# Altium schematic sheet Audio_Det.SchDoc: Mynd-Audio-Detect
size A3; PageSetup: Record=PageOptions|CenterHorizontal=True|CenterVertical=True|PrintScale=0.71|XCorrection=1.00|YCorrection=1.00|PrintKind=0|BorderSize=5000000|LeftOffset=0|BottomOffset=0|Orientation=2|PaperLength=1000|PaperWidth=1000|Scale=100|PaperSource=7|PrintQuality=-3|MediaType=1|DitherType=10|PrintScaleMode=1|PaperKind=A4|PaperIndex=9; SheetNumber: 5; SheetTotal: 6
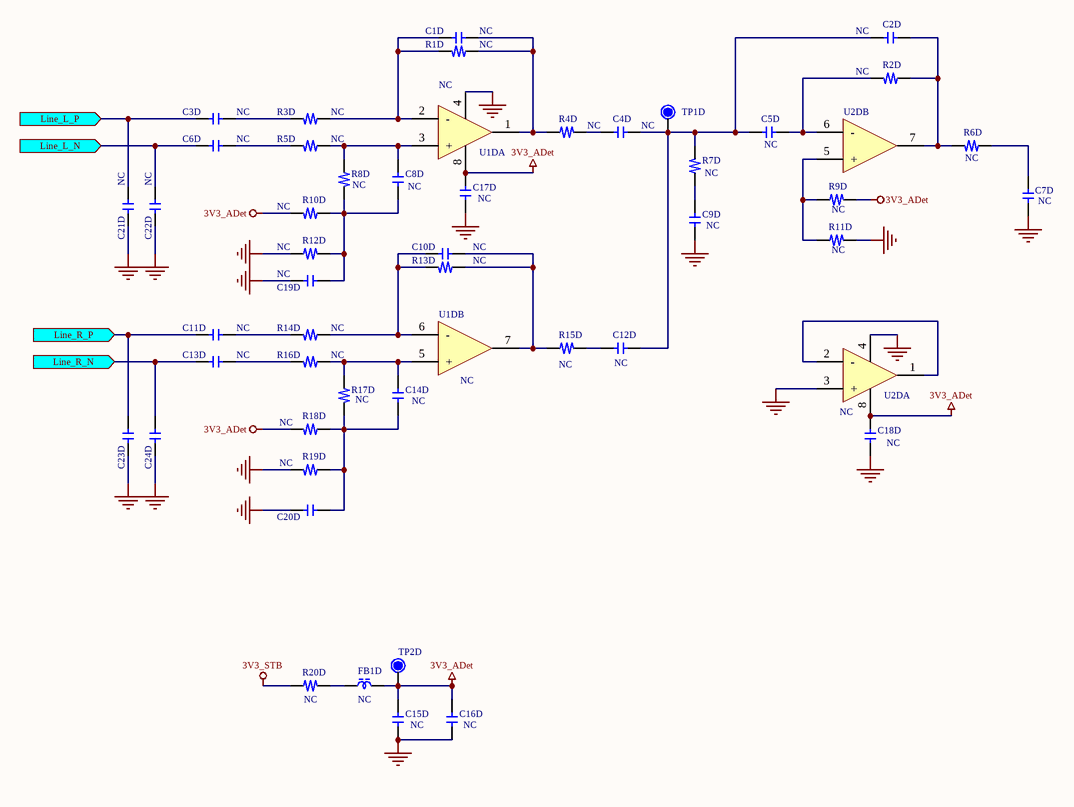
[diagram p0: Audio_Det.SchDoc]

## Parts
C1D  47pF  [C0603X80]  (value not drawn)
C2D  4.7uF  [C0603X100]  (value not drawn)
C3D  100nF  [C0603X100]  (value not drawn)
C4D  470nF  [C0603X100]  (value not drawn)
C5D  150nF  [C0603X100]  (value not drawn)
C6D  100nF  [C0603X100]  (value not drawn)
C7D  10nF  [C0603X100]  (value not drawn)
C8D  47pF  [C0603X80]  (value not drawn)
C9D  10uF  [C0805_145]  (value not drawn)
C10D  47pF  [C0603X80]  (value not drawn)
C11D  100nF  [C0603X100]  (value not drawn)
C12D  470nF  [C0603X100]  (value not drawn)
C13D  100nF  [C0603X100]  (value not drawn)
C14D  47pF  [C0603X80]  (value not drawn)
C15D  10uF  [C0805_145]  (value not drawn)
C16D  100nF  [C0603X100]  (value not drawn)
C17D  100nF  [C0603X100]  (value not drawn)
C18D  100nF  [C0603X100]  (value not drawn)
C19D  4.7uF  [C0603X105]  (value not drawn)
C20D  4.7uF  [C0603X105]  (value not drawn)
C21D  470pF  [C0603X80]  (value not drawn)
C22D  470pF  [C0603X80]  (value not drawn)
C23D  470pF  [C0603X80]  (value not drawn)
C24D  470pF  [C0603X80]  (value not drawn)
FB1D  600R  [L0603]  (value not drawn)
R1D  10k  [R0603]  (value not drawn)
R2D  680k  [R0603]  (value not drawn)
R3D  10k  [R0603]  (value not drawn)
R4D  15R  [R0603]  (value not drawn)
R5D  10k  [R0603]  (value not drawn)
R6D  560R  [R0603]  (value not drawn)
R7D  1.5k  [R0603]  (value not drawn)
R8D  10k  [R0603]  (value not drawn)
R9D  100k  [R0603]  (value not drawn)
R10D  33k  [R0603]  (value not drawn)
R11D  100k  [R0603]  (value not drawn)
R12D  33k  [R0603]  (value not drawn)
R13D  10k  [R0603]  (value not drawn)
R14D  10k  [R0603]  (value not drawn)
R15D  15R  [R0603]  (value not drawn)
R16D  10k  [R0603]  (value not drawn)
R17D  10k  [R0603]  (value not drawn)
R18D  33k  [R0603]  (value not drawn)
R19D  33k  [R0603]  (value not drawn)
R20D  2.2R  [R0805]  (value not drawn)
TP1D  TP  [TP060]  (value not drawn)  (no BOM)
TP2D  TP  [TP060]  (value not drawn)  (no BOM)
U1D  (no value)  [VSSOP8]  (parts A,B of 2)
U2D  (no value)  [VSSOP8]  (parts A,B of 2)

## Ports
Line_L_N (in), Line_L_P (in), Line_R_N (in), Line_R_P (in)

## Nets
3V3_ADet: C15D.2 C16D.1 C17D.1 C18D.1 FB1D.2 R9D.1 R10D.1 R18D.1 TP2D.1 U1D.8(+V) U2D.8(+V)
3V3_STB: R20D.2
GND: C7D.2 C9D.2 C15D.1 C16D.2 C17D.2 C18D.2 C19D.2 C20D.2 C21D.2 C22D.2 C23D.2 C24D.2 R11D.1 R12D.2 R19D.1 U1D.4(-V) U2D.3(+) U2D.4(-V)
Line_L_N: C6D.2 C22D.1 ; port Line_L_N
Line_L_P: C3D.2 C21D.1 ; port Line_L_P
Line_R_N: C13D.2 C24D.1 ; port Line_R_N
Line_R_P: C11D.2 C23D.1 ; port Line_R_P
NetC1D_1: C1D.1 R1D.2 R4D.2 U1D.1(OUT)
NetC1D_2: C1D.2 R1D.1 R3D.2 U1D.2(-)
NetC2D_1: C2D.1 R2D.2 R6D.1 U2D.7(OUT)
NetC2D_2: C2D.2 C4D.1 C5D.2 C12D.1 R7D.1 TP1D.1
NetC3D_1: C3D.1 R3D.1
NetC4D_2: C4D.2 R4D.1
NetC5D_1: C5D.1 R2D.1 U2D.6(-)
NetC6D_1: C6D.1 R5D.1
NetC7D_1: C7D.1 R6D.2
NetC8D_1: C8D.1 C19D.1 R8D.1 R10D.2 R12D.1
NetC8D_2: C8D.2 R5D.2 R8D.2 U1D.3(+)
NetC9D_1: C9D.1 R7D.2
NetC10D_1: C10D.1 R13D.2 R15D.2 U1D.7(OUT)
NetC10D_2: C10D.2 R13D.1 R14D.2 U1D.6(-)
NetC11D_1: C11D.1 R14D.1
NetC12D_2: C12D.2 R15D.1
NetC13D_1: C13D.1 R16D.1
NetC14D_1: C14D.1 C20D.1 R17D.1 R18D.2 R19D.2
NetC14D_2: C14D.2 R16D.2 R17D.2 U1D.5(+)
NetFB1D_1: FB1D.1 R20D.1
NetR9D_2: R9D.2 R11D.2 U2D.5(+)
NetU2D_1: U2D.1(OUT) U2D.2(-)

## Notes on the sheet
- NC
- (near R2D) NC
- (near C2D) NC
- (near C3D) NC
- (near R3D) NC
- (near C5D) NC
- (near R6D) NC
- (near C21D) NC
- (near R10D) NC
- (near R8D) NC
- (near C8D) NC
- (near C17D) NC
- (near R7D) NC
- (near C9D) NC
- (near R9D) NC
- (near C7D) NC
- (near R12D) NC
- (near R11D) NC
- (near C11D) NC
- (near R14D) NC
- (near R18D) NC
- (near R17D) NC
- (near C14D) NC
- (near U1D) NC
- (near R15D) NC
- (near C12D) NC
- (near R19D) NC
- (near C18D) NC
- (near R20D) NC
- (near FB1D) NC
- (near C15D) NC
- (near C16D) NC
- Revision:
- Lautspreecher Teufel GmbH
- Budapester Straße 44
- 10787 Berlin
- Germany
- Page Title:
- Engineer:
- Project:
- Version:
- Rev:
- modified:
- Date:
- Size:
- A3
- File Name:
- Page:
- of

## Library data of the parts
C1D C8D C10D C14D = P-001-0386-16: PSHF SMD M CAP 47pF 50V ±5% 0603 NPO; Manufacturer: Multi Sourced; Part_Number: Generic; Part_Type: Capacitor ceramic SMT; Tolerance: ±5%; TemperatureRange: NPO; Value: 47pF; Temp_Coefficient: NPO; Voltage: 50V
C2D = P-001-0091-32: PSHF SMD M CAP 4.7nF 50V ±10% 0603 X7R; Manufacturer: Multi Sourced; Part_Number: Generic; Part_Type: Capacitor ceramic SMT; Tolerance: ±10%; TemperatureRange: X7R; Value: 4.7uF; Temp_Coefficient: X7R; Voltage: 50V
C3D C6D C11D C13D = P-001-0035-30: GPHF SMD M CAP 100nF 25V ±10% 0603 X7R; Manufacturer: Multi Sourced; Part_Number: Generic; Part_Type: Capacitor ceramic SMT; Tolerance: ±10%; TemperatureRange: X7R; Value: 100nF; Temp_Coefficient: X7R; Voltage: 25V
C4D C12D = P-001-0069-18: PSHF SMD M CAP 470nF 25V ±10% 0603 X7R; Manufacturer: Multi Sourced; Part_Number: Generic; Part_Type: Capacitor ceramic SMT; Tolerance: ±10%; TemperatureRange: X7R; Value: 470nF; Temp_Coefficient: X7R; Voltage: 25V
C5D = P-001-0048-15: PSHF SMD M CAP 150nF 25V ±10% 0603 X7R; Manufacturer: Multi Sourced; Part_Number: Generic; Part_Type: Capacitor ceramic SMT; Tolerance: ±10%; TemperatureRange: X7R; Value: 150nF; Temp_Coefficient: X7R; Voltage: 25V
C7D = P-001-0058-45: PSHF SMD M CAP 10nF 50V ±10% 0603 X7R; Manufacturer: Multi Sourced; Part_Number: Generic; Part_Type: Capacitor ceramic SMT; Tolerance: ±10%; TemperatureRange: X7R; Value: 10nF; Temp_Coefficient: X7R; Voltage: 50V
C9D C15D = P-001-0158-27: PSHF SMD M CAP 10uF 16V ±10% 0805 X7R; Manufacturer: Multi Sourced; Part_Number: Generic; Part_Type: Capacitor ceramic SMT; Tolerance: ±10%; TemperatureRange: X7R; Value: 10uF; Temp_Coefficient: X7R; Voltage: 16V
C16D C17D C18D = P-001-0035-28: PSHF SMD M CAP 100nF 25V ±10% 0603 X7R; Manufacturer: Multi Sourced; Part_Number: Generic; Part_Type: Capacitor ceramic SMT; Tolerance: ±10%; TemperatureRange: X7R; Value: 100nF; Temp_Coefficient: X7R; Voltage: 25V
C19D C20D = P-001-0407-39: GPHF SMD M CAP 4.7uF 16V ±10% 0603 X5R; Manufacturer: Multi Sourced; Part_Number: Generic; Part_Type: Capacitor ceramic SMT; Tolerance: ±10%; TemperatureRange: X5R; Value: 4.7uF; Temp_Coefficient: X5R; Voltage: 16V
C21D C22D C23D C24D = P-001-0647-10: GPHF SMD CAP 470pF 50V 10%; Manufacturer: Multi Sourced; Part_Number: Generic; Part_Type: Capacitor ceramic SMT; TemperatureRange: X7R; Tolerance: ±10%; Value: 470pF; Temp_Coefficient: X7R; Voltage: 50V
FB1D = S-001-0006-21: PS SMD FERRITE BEAD 600OHM 25% 0603; Manufacturer: [TSA]; Part_Number: FCM1608KF-601T05; Part_Type: Ferrite Bead SMT; Current: 0.5A; Tolerance: 1:25%; Frequency: 100MHz; Value: 600R
R1D R3D R5D R8D R13D R14D R16D R17D = Q-001-0036-51: GPHF SMD RES. 10KOHM 1/10W 1% 0603; Manufacturer: Multi-Sourced; Part_Number: Generic; Part_Type: Resistor SMT; Temp_Coefficient: 150ppm; Tolerance: 1%; Wattage: 1/10W; Value: 10k
R2D = Q-001-0105-18: PS SMD RES. 680KOHM 1/10W 5% 0603; Part_Type: Resistor SMT; Manufacturer: Multi-Sourced; Part_Number: Generic; Tolerance: 1%; Temp_Coefficient: 150ppm; Value: 680k; Wattage: 1/10W
R4D R15D = Q-001-0210-18: PS SMD RES. 15OHM 1/10W 5% 0603; Part_Type: Resistor SMT; Manufacturer: Multi-Sourced; Part_Number: Generic; Tolerance: 1%; Temp_Coefficient: 150ppm; Value: 15R; Wattage: 1/10W
R6D = Q-001-0486-22: PS SMD RES. 560OHM 1/10W 1% 0603; Part_Type: Resistor SMT; Manufacturer: Multi-Sourced; Part_Number: Generic; Temp_Coefficient: 150ppm; Tolerance: 1%; Value: 560R; Wattage: 1/10W
R7D = Q-001-0319-26: PS SMD RES. 1.5KOHM 1/10W 1% 0603; Part_Type: Resistor SMT; Manufacturer: Multi-Sourced; Part_Number: Generic; Temp_Coefficient: 150ppm; Tolerance: 1%; Value: 1.5k; Wattage: 1/10W
R9D R11D = Q-001-0032-52: PS SMD RES. 100KOHM 1/10W 1% 0603; Part_Type: Resistor SMT; Manufacturer: Multi-Sourced; Part_Number: Generic; Temp_Coefficient: 150ppm; Tolerance: 1%; Value: 100k; Wattage: 1/10W
R10D R12D R18D R19D = Q-001-0388-42: PS SMD RES. 33KOHM 1/10W 1% 0603; Part_Type: Resistor SMT; Manufacturer: Multi-Sourced; Part_Number: Generic; Temp_Coefficient: 150ppm; Tolerance: 1%; Value: 33k; Wattage: 1/10W
R20D = Q-001-0630-17: PS SMD RES. 2.2OHM 1/8W 1% 0805; Part_Type: Resistor SMT; Manufacturer: Multi-Sourced; Part_Number: Generic; Temp_Coefficient: 150ppm; Tolerance: 1%; Value: 2.2R; Wattage: 1/8W
TP1D TP2D = N-001-00007-3: Test Point; Design Item ID: TP
U1D U2D = R-001-1647-2: SMD IC 8P MSOP SGM358YMS SGMICRO; Part_Type: Semiconductor Integrated Circuit SMT; Manufacturer: SGMICRO; Part_Number: SGM358YMS; Value: SGM358YMS